# EAGLE schematic Main Board Schematic v6 (EAGLE 9.7.0)
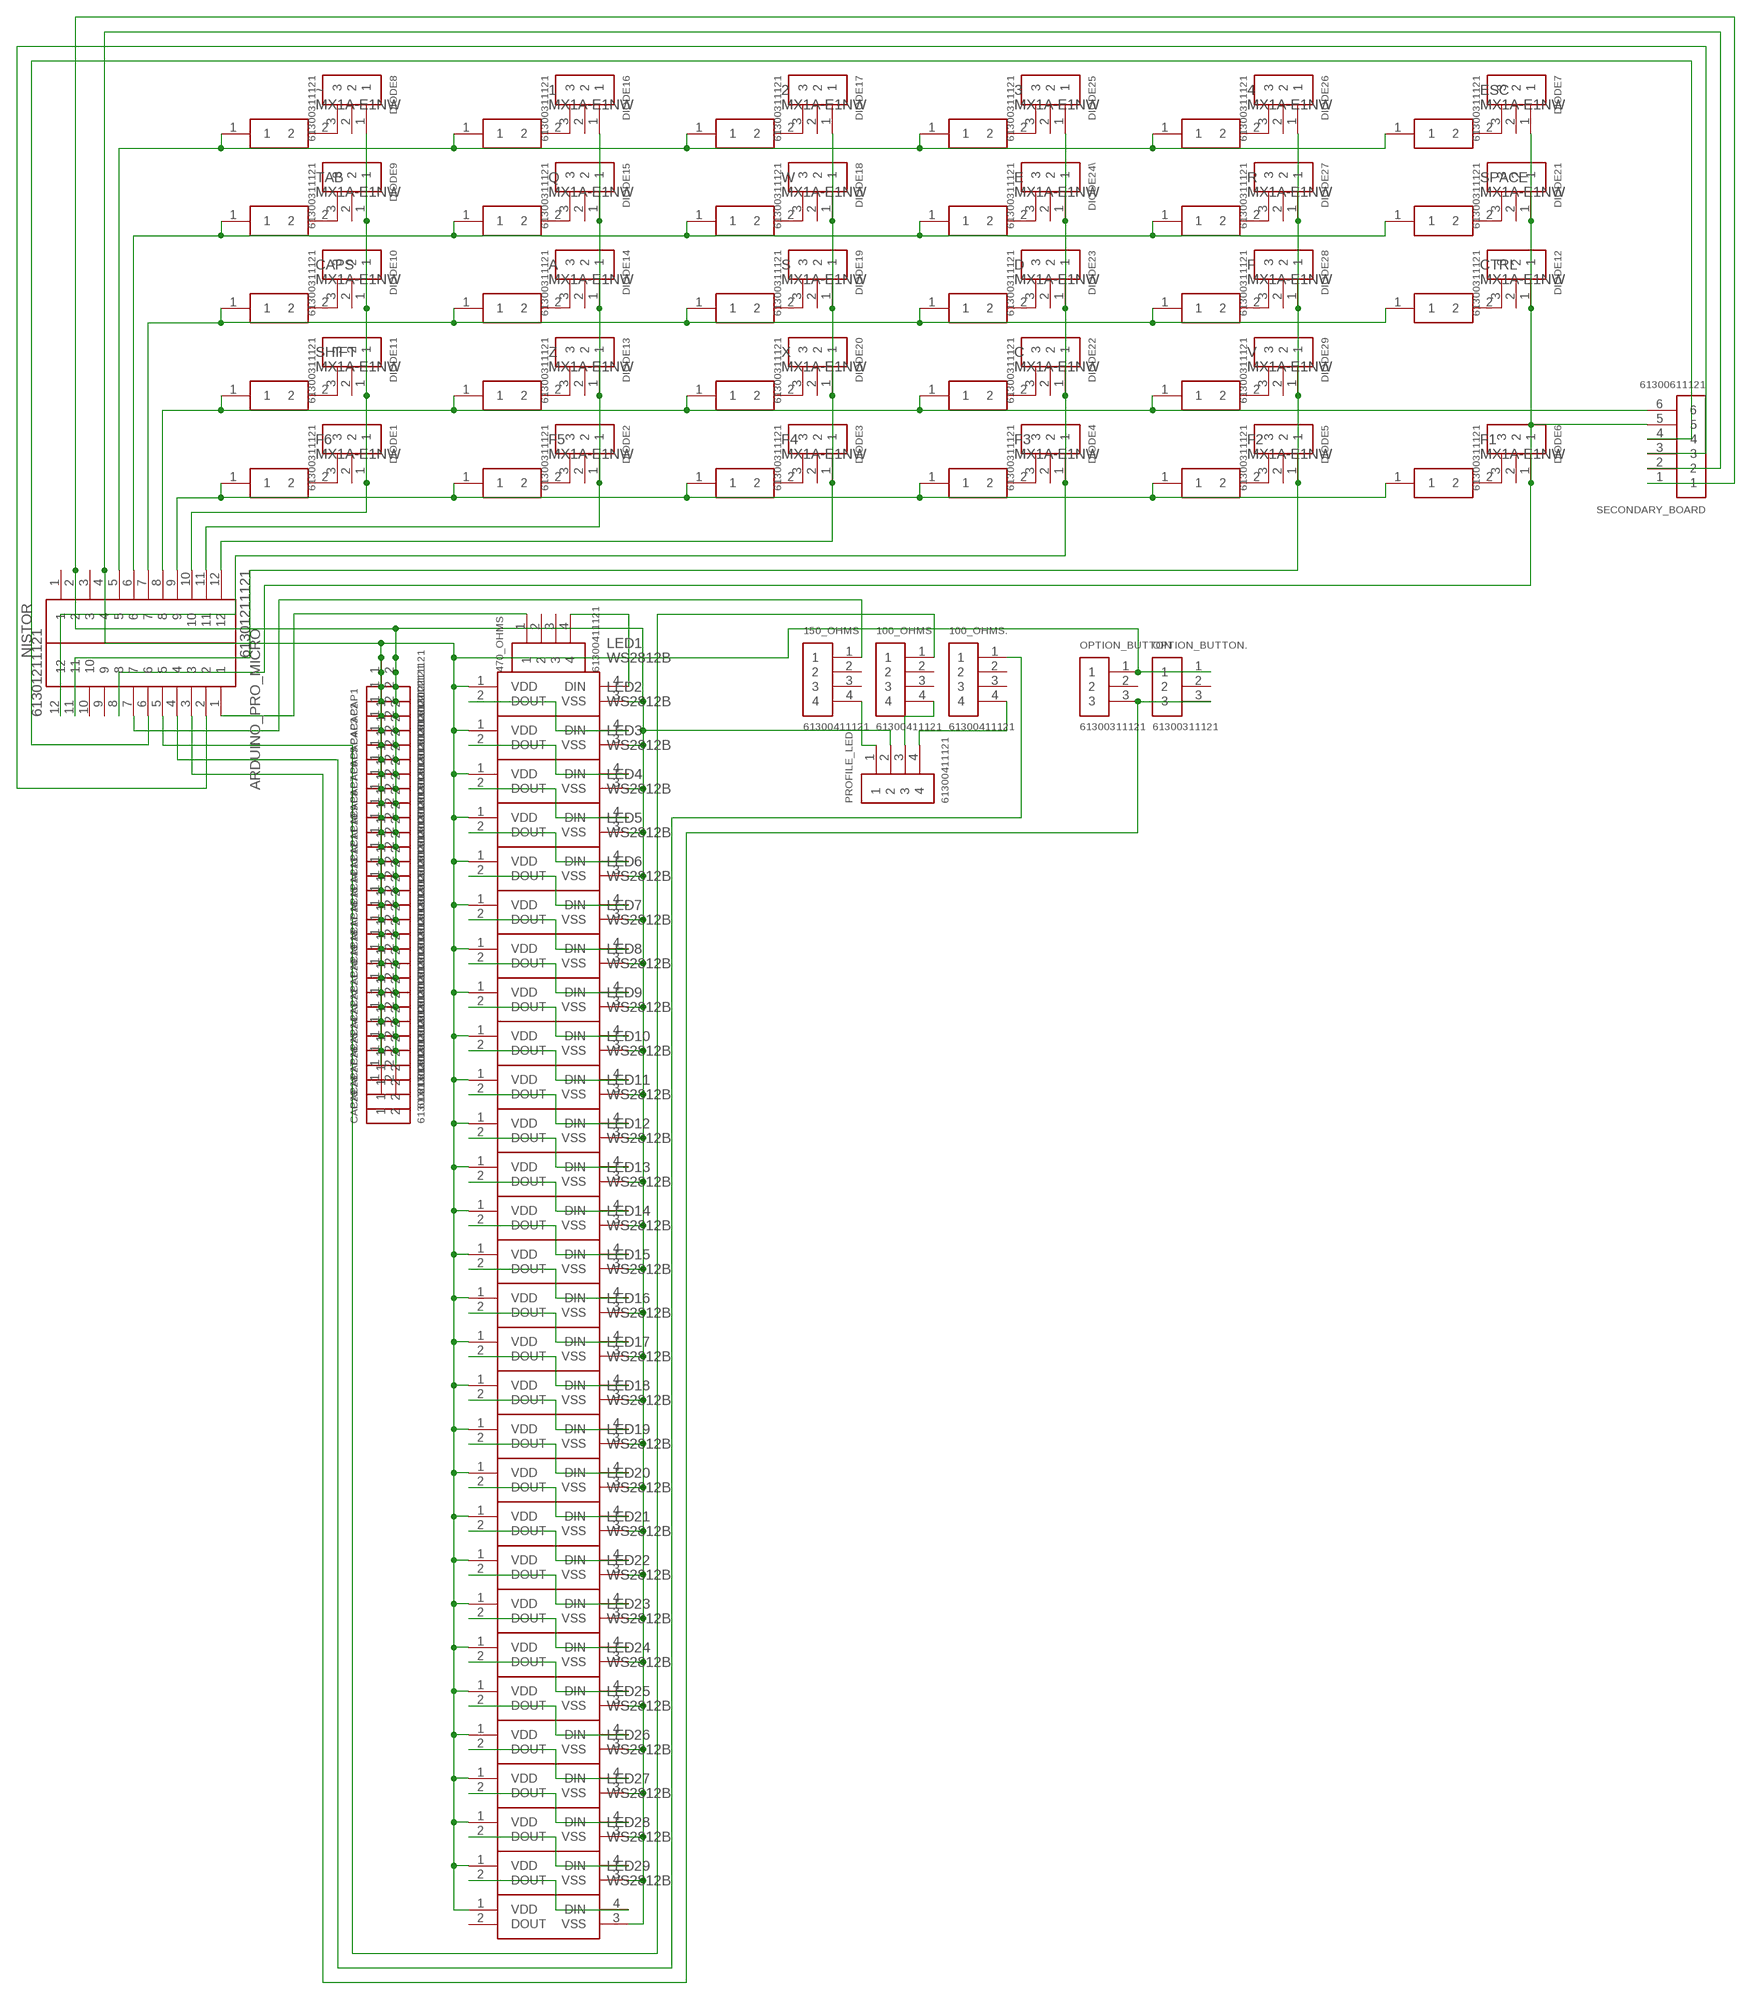
[diagram p0: schematic, sheet 1]

## Parts
1  MX1A-E1NW  [MX1AE1NW]
2  MX1A-E1NW  [MX1AE1NW]
3  MX1A-E1NW  [MX1AE1NW]
4  MX1A-E1NW  [MX1AE1NW]
100_OHMS  61300411121  [61300411121]
100_OHMS.  61300411121  [61300411121]
150_OHMS  61300411121  [61300411121]
470_OHMS  61300411121  [61300411121]
A  MX1A-E1NW  [MX1AE1NW]
ARDUINO_PRO_MICRO  61301211121  [61301211121]
C  MX1A-E1NW  [MX1AE1NW]
CAP1  61300211121  [61300211121]
CAP2  61300211121  [61300211121]
CAP3  61300211121  [61300211121]
CAP4  61300211121  [61300211121]
CAP5  61300211121  [61300211121]
CAP6  61300211121  [61300211121]
CAP7  61300211121  [61300211121]
CAP8  61300211121  [61300211121]
CAP9  61300211121  [61300211121]
CAP10  61300211121  [61300211121]
CAP11  61300211121  [61300211121]
CAP12  61300211121  [61300211121]
CAP13  61300211121  [61300211121]
CAP14  61300211121  [61300211121]
CAP15  61300211121  [61300211121]
CAP16  61300211121  [61300211121]
CAP17  61300211121  [61300211121]
CAP18  61300211121  [61300211121]
CAP19  61300211121  [61300211121]
CAP20  61300211121  [61300211121]
CAP21  61300211121  [61300211121]
CAP22  61300211121  [61300211121]
CAP23  61300211121  [61300211121]
CAP24  61300211121  [61300211121]
CAP25  61300211121  [61300211121]
CAP26  61300211121  [61300211121]
CAP27  61300211121  [61300211121]
CAP28  61300211121  [61300211121]
CAP29  61300211121  [61300211121]
CAPS  MX1A-E1NW  [MX1AE1NW]
CTRL  MX1A-E1NW  [MX1AE1NW]
D  MX1A-E1NW  [MX1AE1NW]
DIODE1  61300311121  [61300311121]
DIODE2  61300311121  [61300311121]
DIODE3  61300311121  [61300311121]
DIODE4  61300311121  [61300311121]
DIODE5  61300311121  [61300311121]
DIODE6  61300311121  [61300311121]
DIODE7  61300311121  [61300311121]
DIODE8  61300311121  [61300311121]
DIODE9  61300311121  [61300311121]
DIODE10  61300311121  [61300311121]
DIODE11  61300311121  [61300311121]
DIODE12  61300311121  [61300311121]
DIODE13  61300311121  [61300311121]
DIODE14  61300311121  [61300311121]
DIODE15  61300311121  [61300311121]
DIODE16  61300311121  [61300311121]
DIODE17  61300311121  [61300311121]
DIODE18  61300311121  [61300311121]
DIODE19  61300311121  [61300311121]
DIODE20  61300311121  [61300311121]
DIODE21  61300311121  [61300311121]
DIODE22  61300311121  [61300311121]
DIODE23  61300311121  [61300311121]
DIODE24\  61300311121  [61300311121]
DIODE25  61300311121  [61300311121]
DIODE26  61300311121  [61300311121]
DIODE27  61300311121  [61300311121]
DIODE28  61300311121  [61300311121]
DIODE29  61300311121  [61300311121]
E  MX1A-E1NW  [MX1AE1NW]
ESC  MX1A-E1NW  [MX1AE1NW]
F  MX1A-E1NW  [MX1AE1NW]
F1  MX1A-E1NW  [MX1AE1NW]
F2  MX1A-E1NW  [MX1AE1NW]
F3  MX1A-E1NW  [MX1AE1NW]
F4  MX1A-E1NW  [MX1AE1NW]
F5  MX1A-E1NW  [MX1AE1NW]
F6  MX1A-E1NW  [MX1AE1NW]
LED1  WS2812B  [WS2812B]
LED2  WS2812B  [WS2812B]
LED3  WS2812B  [WS2812B]
LED4  WS2812B  [WS2812B]
LED5  WS2812B  [WS2812B]
LED6  WS2812B  [WS2812B]
LED7  WS2812B  [WS2812B]
LED8  WS2812B  [WS2812B]
LED9  WS2812B  [WS2812B]
LED10  WS2812B  [WS2812B]
LED11  WS2812B  [WS2812B]
LED12  WS2812B  [WS2812B]
LED13  WS2812B  [WS2812B]
LED14  WS2812B  [WS2812B]
LED15  WS2812B  [WS2812B]
LED16  WS2812B  [WS2812B]
LED17  WS2812B  [WS2812B]
LED18  WS2812B  [WS2812B]
LED19  WS2812B  [WS2812B]
LED20  WS2812B  [WS2812B]
LED21  WS2812B  [WS2812B]
LED22  WS2812B  [WS2812B]
LED23  WS2812B  [WS2812B]
LED24  WS2812B  [WS2812B]
LED25  WS2812B  [WS2812B]
LED26  WS2812B  [WS2812B]
LED27  WS2812B  [WS2812B]
LED28  WS2812B  [WS2812B]
LED29  WS2812B  [WS2812B]
NISTOR  61301211121  [61301211121]
OPTION_BUTTON  61300311121  [61300311121]
OPTION_BUTTON.  61300311121  [61300311121]
PROFILE_LED  61300411121  [61300411121]
Q  MX1A-E1NW  [MX1AE1NW]
R  MX1A-E1NW  [MX1AE1NW]
S  MX1A-E1NW  [MX1AE1NW]
SECONDARY_BOARD  61300611121  [61300611121]
SHIFT  MX1A-E1NW  [MX1AE1NW]
SPACE  MX1A-E1NW  [MX1AE1NW]
TAB  MX1A-E1NW  [MX1AE1NW]
V  MX1A-E1NW  [MX1AE1NW]
W  MX1A-E1NW  [MX1AE1NW]
X  MX1A-E1NW  [MX1AE1NW]
Z  MX1A-E1NW  [MX1AE1NW]
~  MX1A-E1NW  [MX1AE1NW]

## Nets
N$1: DIODE8.3 ~.2
N$2: DIODE9.3 TAB.2
N$3: CAPS.2 DIODE10.3
N$4: DIODE11.3 SHIFT.2
N$5: DIODE1.3 F6.2
N$6: 1.2 DIODE16.3
N$7: DIODE15.3 Q.2
N$8: A.2 DIODE14.3
N$9: DIODE13.3 Z.2
N$10: DIODE2.3 F5.2
N$11: DIODE3.3 F4.2
N$12: DIODE20.3 X.2
N$13: DIODE19.3 S.2
N$14: DIODE18.3 W.2
N$15: 2.2 DIODE17.3
N$16: 3.2 DIODE25.3
N$17: DIODE24\.3 E.2
N$18: D.2 DIODE23.3
N$19: C.2 DIODE22.3
N$20: DIODE4.3 F3.2
N$21: DIODE5.3 F2.2
N$22: DIODE29.3 V.2
N$23: DIODE28.3 F.2
N$24: DIODE27.3 R.2
N$25: 4.2 DIODE26.3
N$26: DIODE7.3 ESC.2
N$27: DIODE21.3 SPACE.2
N$28: CTRL.2 DIODE12.3
N$29: DIODE6.3 F1.2
N$30: 1.1 2.1 3.1 4.1 ESC.1 NISTOR.5 ~.1
N$31: E.1 NISTOR.6 Q.1 R.1 SPACE.1 TAB.1 W.1
N$32: A.1 CAPS.1 CTRL.1 D.1 F.1 NISTOR.7 S.1
N$33: C.1 NISTOR.8 SECONDARY_BOARD.6 SHIFT.1 V.1 X.1 Z.1
N$34: F1.1 F2.1 F3.1 F4.1 F5.1 F6.1 NISTOR.9
N$35: DIODE1.1 DIODE8.1 DIODE9.1 DIODE10.1 DIODE11.1 NISTOR.10
N$36: DIODE2.1 DIODE13.1 DIODE14.1 DIODE15.1 DIODE16.1 NISTOR.11
N$37: DIODE3.1 DIODE17.1 DIODE18.1 DIODE19.1 DIODE20.1 NISTOR.12
N$38: ARDUINO_PRO_MICRO.12 DIODE4.1 DIODE22.1 DIODE23.1 DIODE24\.1 DIODE25.1
N$39: ARDUINO_PRO_MICRO.11 DIODE5.1 DIODE26.1 DIODE27.1 DIODE28.1 DIODE29.1
N$40: ARDUINO_PRO_MICRO.8 DIODE6.1 DIODE7.1 DIODE12.1 DIODE21.1 SECONDARY_BOARD.5
N$41: 150_OHMS.1 ARDUINO_PRO_MICRO.7
N$42: CAP1.1 CAP2.1 CAP3.1 CAP4.1 CAP5.1 CAP6.1 CAP7.1 CAP8.1 CAP9.1 CAP10.1 CAP11.1 CAP12.1 CAP13.1 CAP14.1 CAP15.1 CAP16.1 CAP17.1 CAP18.1 CAP19.1 CAP20.1 CAP21.1 CAP22.1 CAP23.1 CAP24.1 CAP25.1 CAP26.1 CAP27.1 CAP28.1 CAP29.1 LED1.1(VDD) LED2.1(VDD) LED3.1(VDD) LED4.1(VDD) LED5.1(VDD) LED6.1(VDD) LED7.1(VDD) LED8.1(VDD) LED9.1(VDD) LED10.1(VDD) LED11.1(VDD) LED12.1(VDD) LED13.1(VDD) LED14.1(VDD) LED15.1(VDD) LED16.1(VDD) LED17.1(VDD) LED18.1(VDD) LED19.1(VDD) LED20.1(VDD) LED21.1(VDD) LED22.1(VDD) LED23.1(VDD) LED24.1(VDD) LED25.1(VDD) LED26.1(VDD) LED27.1(VDD) LED28.1(VDD) LED29.1(VDD) NISTOR.4 OPTION_BUTTON.1 OPTION_BUTTON..1 SECONDARY_BOARD.2
N$43: ARDUINO_PRO_MICRO.6 SECONDARY_BOARD.4
N$44: ARDUINO_PRO_MICRO.3 OPTION_BUTTON.3 OPTION_BUTTON..3
N$45: 150_OHMS.4 PROFILE_LED.1
N$46: 100_OHMS.4 PROFILE_LED.3
N$47: 100_OHMS..4 PROFILE_LED.4
N$48: 470_OHMS.4 LED1.4(DIN)
N$49: CAP1.2 CAP2.2 CAP3.2 CAP4.2 CAP5.2 CAP6.2 CAP7.2 CAP8.2 CAP9.2 CAP10.2 CAP11.2 CAP12.2 CAP13.2 CAP14.2 CAP15.2 CAP16.2 CAP17.2 CAP18.2 CAP19.2 CAP20.2 CAP21.2 CAP22.2 CAP23.2 CAP24.2 CAP25.2 CAP26.2 CAP27.2 CAP28.2 CAP29.2 LED1.3(VSS) LED2.3(VSS) LED3.3(VSS) LED4.3(VSS) LED5.3(VSS) LED6.3(VSS) LED7.3(VSS) LED8.3(VSS) LED9.3(VSS) LED10.3(VSS) LED11.3(VSS) LED12.3(VSS) LED13.3(VSS) LED14.3(VSS) LED15.3(VSS) LED16.3(VSS) LED17.3(VSS) LED18.3(VSS) LED19.3(VSS) LED20.3(VSS) LED21.3(VSS) LED22.3(VSS) LED23.3(VSS) LED24.3(VSS) LED25.3(VSS) LED26.3(VSS) LED27.3(VSS) LED28.3(VSS) LED29.3(VSS) NISTOR.2 PROFILE_LED.2 SECONDARY_BOARD.1
N$50: 100_OHMS.1 ARDUINO_PRO_MICRO.5
N$51: LED1.2(DOUT) LED2.4(DIN)
N$52: LED2.2(DOUT) LED3.4(DIN)
N$53: LED3.2(DOUT) LED4.4(DIN)
N$54: LED4.2(DOUT) LED5.4(DIN)
N$55: LED5.2(DOUT) LED6.4(DIN)
N$56: LED6.2(DOUT) LED7.4(DIN)
N$57: LED7.2(DOUT) LED8.4(DIN)
N$58: LED8.2(DOUT) LED9.4(DIN)
N$59: LED9.2(DOUT) LED10.4(DIN)
N$60: LED10.2(DOUT) LED11.4(DIN)
N$61: LED11.2(DOUT) LED12.4(DIN)
N$62: LED12.2(DOUT) LED13.4(DIN)
N$63: LED13.2(DOUT) LED14.4(DIN)
N$64: LED14.2(DOUT) LED15.4(DIN)
N$65: LED15.2(DOUT) LED16.4(DIN)
N$66: LED16.2(DOUT) LED17.4(DIN)
N$67: LED17.2(DOUT) LED18.4(DIN)
N$68: LED18.2(DOUT) LED19.4(DIN)
N$69: LED19.2(DOUT) LED20.4(DIN)
N$70: LED20.2(DOUT) LED21.4(DIN)
N$71: LED21.2(DOUT) LED22.4(DIN)
N$72: LED22.2(DOUT) LED23.4(DIN)
N$73: LED23.2(DOUT) LED24.4(DIN)
N$74: LED24.2(DOUT) LED25.4(DIN)
N$75: LED25.2(DOUT) LED26.4(DIN)
N$76: LED26.2(DOUT) LED27.4(DIN)
N$77: LED27.2(DOUT) LED28.4(DIN)
N$78: LED28.2(DOUT) LED29.4(DIN)
N$79: 100_OHMS..1 ARDUINO_PRO_MICRO.4
N$80: ARDUINO_PRO_MICRO.2 SECONDARY_BOARD.3
N$81: 470_OHMS.1 ARDUINO_PRO_MICRO.1
Unconnected: 100_OHMS.2 100_OHMS.3 100_OHMS..2 100_OHMS..3 150_OHMS.2 150_OHMS.3 470_OHMS.2 470_OHMS.3 ARDUINO_PRO_MICRO.9 ARDUINO_PRO_MICRO.10 DIODE1.2 DIODE2.2 DIODE3.2 DIODE4.2 DIODE5.2 DIODE6.2 DIODE7.2 DIODE8.2 DIODE9.2 DIODE10.2 DIODE11.2 DIODE12.2 DIODE13.2 DIODE14.2 DIODE15.2 DIODE16.2 DIODE17.2 DIODE18.2 DIODE19.2 DIODE20.2 DIODE21.2 DIODE22.2 DIODE23.2 DIODE24\.2 DIODE25.2 DIODE26.2 DIODE27.2 DIODE28.2 DIODE29.2 LED29.2(DOUT) NISTOR.1 NISTOR.3 OPTION_BUTTON.2 OPTION_BUTTON..2

## Library data of the parts
1-4 A C CAPS CTRL D E ESC F F1-F6 Q R S SHIFT SPACE TAB V W X Z ~ = SamacSys_Parts:MX1A-E1NW: Pushbutton Switches Full Travel, Mech. Keyswitch, Click Tactile Feel (Blue stem), 60cN, No LED, No Diode, Fixation Pins for PCB Mounting Source: Datasheet <https://media.digikey.com/pdf/Data Sheets/Cherry PDFs/MX Series.pdf>; DESCRIPTION: Pushbutton Switches Full Travel, Mech. Keyswitch, Click Tactile Feel (Blue stem), 60cN, No LED, No Diode, Fixation Pins for PCB Mounting; HEIGHT: 15.2mm; MANUFACTURER_NAME: Cherry; MANUFACTURER_PART_NUMBER: MX1A-E1NW; MOUSER_PART_NUMBER: 540-MX1A-E1NW; MOUSER_PRICE-STOCK: https://www.mouser.co.uk/ProductDetail/CHERRY/MX1A-E1NW/?qs=Z7NFYKyvgJd45Wm4xzFv7w%3D%3D
100_OHMS 100_OHMS. 150_OHMS 470_OHMS PROFILE_LED = Headers:61300411121: CONN HEADER VERT 4POS 2.54MM Manufacturer's datasheet <https://katalog.we-online.de/em/datasheet/6130xx11121.pdf>; CREATED_BY: PCBLayout.com; DIGI_KEY_PART_NUMBER: 732-5317-ND; MANUFACTURER: Wurth Electronics Inc.; MPN: 61300411121
ARDUINO_PRO_MICRO NISTOR = Headers:61301211121: CONN HEADER VERT 12POS 2.54MM Manufacturer's datasheet <https://katalog.we-online.de/em/datasheet/6130xx11121.pdf>; CREATED_BY: PCBLayout.com; DIGIKEY_PART_NUMBER: 732-5323-ND; MANUFACTURER: Wurth Electronics Inc.; MPN: 61301211121
CAP1-CAP29 = Headers:61300211121: CONN HEADER VERT 2POS 2.54MM Manufacturer's datasheet <https://katalog.we-online.de/em/datasheet/6130xx11121.pdf>; CREATED_BY: PCBLayout.com; DIGI_KEY_PART_NUMBER: 732-5315-ND; MANUFACTURER: Wurth Electronics Inc.; MPN: 61300211121
DIODE1-DIODE23 DIODE24\ DIODE25-DIODE29 OPTION_BUTTON OPTION_BUTTON. = Headers:61300311121: CONN HEADER VERT 3POS 2.54MM Manufacturer's datasheet <https://katalog.we-online.de/em/datasheet/6130xx11121.pdf>; CREATED_BY: PCBLayout.com; DIGI_KEY_PART_NUMBER: 732-5316-ND; MANUFACTURER: Wurth Electronics Inc.; MPN: 61300311121
LED1-LED29 = WS2812B:WS2812B: Intelligent control LED integrated light source Source: Datasheet <https://www.adafruit.com/datasheets/WS2812B.pdf>; DESCRIPTION: Intelligent control LED integrated light source; HEIGHT: mm; MANUFACTURER_NAME: Worldsemi; MANUFACTURER_PART_NUMBER: WS2812B
SECONDARY_BOARD = Headers:61300611121: CONN HEADER VERT 6POS 2.54MM Manufacturer's datasheet <https://katalog.we-online.de/em/datasheet/6130xx11121.pdf>; CREATED_BY: PCBLayout.com; DIGI_KEY_PART_NUMBER: 732-5319-ND; MANUFACTURER: Wurth Electronics Inc.; MPN: 61300611121